# Altium schematic sheet Thermostat Power Supply.SchDoc
size A
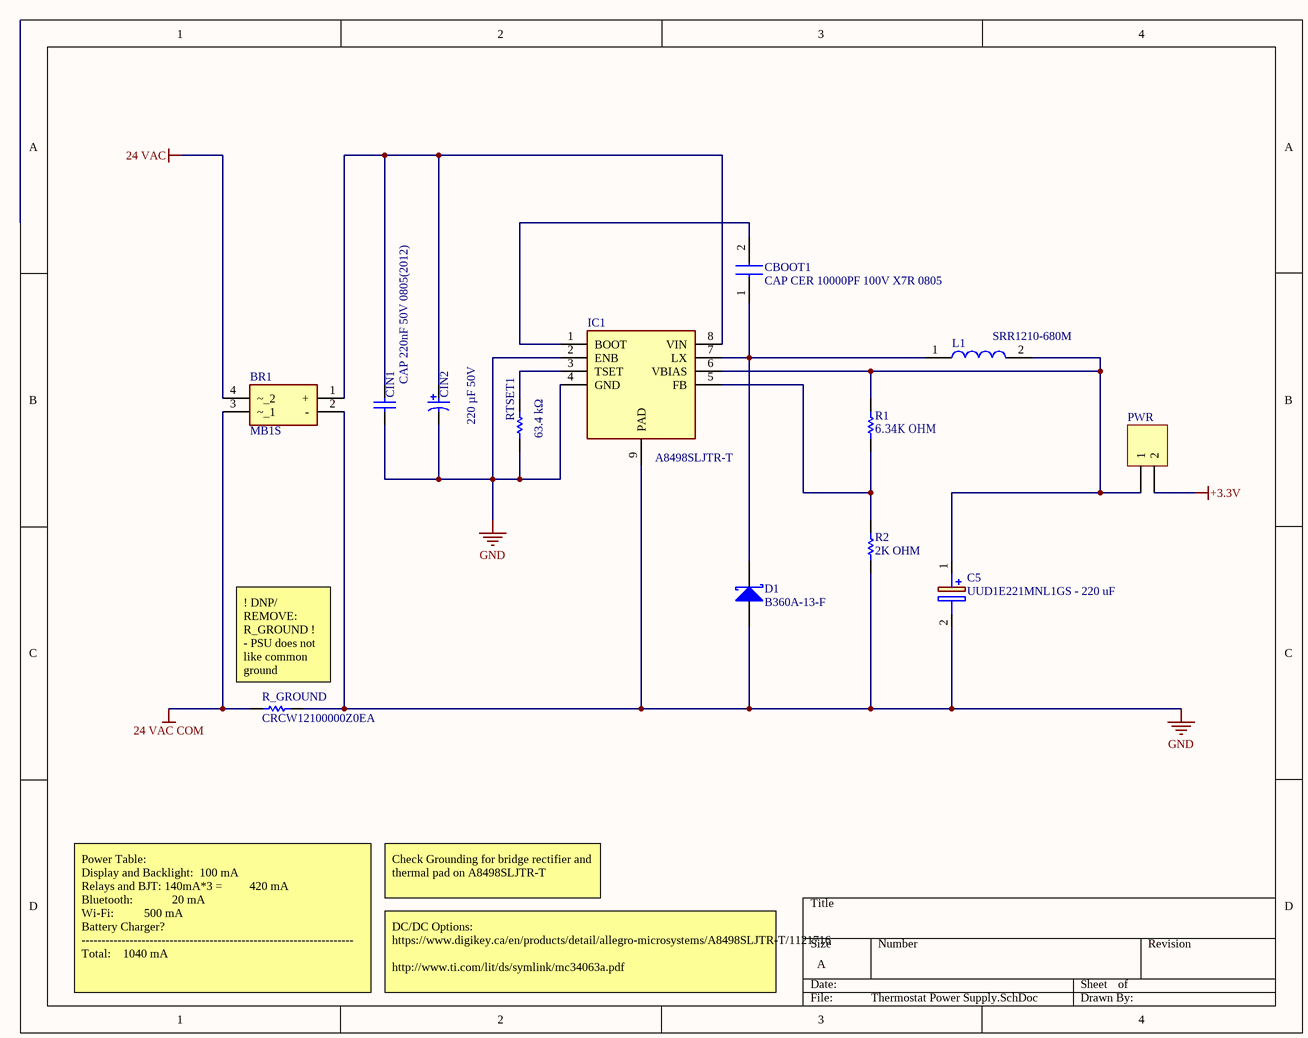
[diagram p0: Thermostat Power Supply.SchDoc]

## Parts
BR1  MB1S  [SOP245P670X290-4N]
C5  UUD1E221MNL1GS - 220 uF  [CAPAE830X1050N]
CBOOT1  CAP CER 10000PF 100V X7R 0805  [CAPC2012X88N]
CIN1  CAP 220nF 50V 0805(2012)  [CAPC0805(2012)145_N]
CIN2  220 µF 50V  [NIC-CAPA2-10X10_V]
D1  B360A-13-F  [DIOD-B360A_V]
IC1  A8498SLJTR-T  [SOIC127P600X170-9N]
L1  SRR1210-680M  [SRR1210]
PWR  Header 2  [HDR1X2]  (value not drawn)
R1  ‎6.34K OHM ‎  [RESC2013X60X35NL10T20]
R2  2K OHM  [RESC2013X60X35ML10T20]
R_GROUND  CRCW12100000Z0EA  [RESC3225X60X45NL20T20]
RTSET1  63.4 kΩ  [RESC2013X60X40NL20T25]

## Nets
24 VAC: BR1.4(~_2)
24 VAC COM: BR1.3(~_1) R_GROUND.1
+3.3V: PWR.2
GND: BR1.2(-) C5.2(-) CIN1.1 CIN2.2 D1.1(A) IC1.2(ENB) IC1.4(GND) IC1.9(PAD) R2.1 R_GROUND.2 RTSET1.1
NetBR1_1: BR1.1(+) CIN1.2 CIN2.1 IC1.8(VIN)
NetC5_1: C5.1(+) IC1.6(VBIAS) L1.2 PWR.1 R1.2
NetCBOOT1_1: CBOOT1.1 D1.2(K) IC1.7(LX) L1.1
NetCBOOT1_2: CBOOT1.2 IC1.1(BOOT)
NetIC1_3: IC1.3(TSET) RTSET1.2
NetIC1_5: IC1.5(FB) R1.1 R2.2

## Notes on the sheet
- (near R_GROUND) ! DNP/ REMOVE: R_GROUND !
  - PSU does not like common ground
- Check Grounding for bridge rectifier and thermal pad on A8498SLJTR-T
- Power Table:
  Display and Backlight: 	100 mA
  Relays and BJT: 140mA*3 =         420 mA
  Bluetooth:		           20 mA
  Wi-Fi:			       500 mA
  Battery Charger?
  --------------------------------------------------------------------
  Total:			 1040 mA
- DC/DC Options:
  https://www.digikey.ca/en/products/detail/allegro-microsystems/A8498SLJTR-T/1121716
  http://www.ti.com/lit/ds/symlink/mc34063a.pdf

## Library data of the parts
BR1 = MB1S: Bridge Rectifier; Manufacturer_Name: ON Semiconductor; Datasheet Link: http://www.onsemi.com/pub/Collateral/MB8S-D.PDF; Height: 2.9mm; Manufacturer_Part_Number: MB1S; Arrow Part Number: MB1S; Arrow Price/Stock: https://www.arrow.com/en/products/mb1s/on-semiconductor; Mouser Part Number: 512-MB1S; Mouser Price/Stock: https://www.mouser.co.uk/ProductDetail/ON-Semiconductor-Fairchild/MB1S?qs=DPwKKv7J1fwyOHno5d2nnw%3D%3D
C5 = UUD1E221MNL1GS: Capacitor Polarised; Manufacturer_Name: Nichicon; Datasheet Link: https://www.mouser.com/datasheet/2/293/e-uud-1513238.pdf; Height: 10.5mm; Manufacturer_Part_Number: UUD1E221MNL1GS; Arrow Part Number: UUD1E221MNL1GS; Arrow Price/Stock: https://www.arrow.com/en/products/uud1e221mnl1gs/nichicon; Mouser Part Number: 647-UUD1E221MNL; Mouser Price/Stock: https://www.mouser.com/Search/Refine.aspx?Keyword=647-UUD1E221MNL
CBOOT1 = C0805C103K1RACTU: Capacitor; Manufacturer_Name: Kemet; Datasheet Link: http://uk.rs-online.com/web/p/products/2989309; Height: 0.88mm; Manufacturer_Part_Number: C0805C103K1RACTU; Arrow Part Number: C0805C103K1RACTU; Arrow Price/Stock: https://www.arrow.com/en/products/c0805c103k1ractu/kemet-corporation; Mouser Part Number: 80-C0805C103K1R; Mouser Price/Stock: https://www.mouser.co.uk/ProductDetail/KEMET/C0805C103K1RACTU?qs=5x48ZXzl2vJIYri9GAI7yw%3D%3D
CIN1 = CMP-1036-04552-1: CAP 220nF 50V ±10% 0805 (2012 Metric) Thickness 1.45mm SMD; Tolerance: Â±10%; Case-Metric: 2012; Case-EIA: 0805; Value: 220nF; Max Thickness: 1.45 mm; Technology: SMT; Rated Voltage: 50 V
CIN2 = CMP-0687-00004-1: Aluminum Electrolytic Capacitor, UD Series, Low Impedance, 220 uF, 50 V, + / - 20%, -55 to 105 degC, Chip Type, 10 x 10 mm D x L, Pb-Free, Reel; PartNumber: UUD1H221MNL1GS; Manufacturer: Nichicon; Rated Capacitance: 220 uF; Packing: Dia382mm Reel; Endurance Time: 5000 h; Rated Ripple Current (at 100kHz): 670 mA; Tolerance Rated Capacitance: -20 to 20%; Impedance: 0.18 Ohm; RoHS: TRUE; ComponentLink2URL: http://products.nichicon.co.jp/en/pdf/XJA043/e-ud.pdf; ComponentLink3URL: http://products.nichicon.co.jp/en/pdf/XJA043/e-ud.pdf; Mounting Technology: Surface Mount; ComponentLink1Description: Manufacturer URL; ComponentLink3Description: Package Specification; ComponentLink1URL: http://www.nichicon.co.jp/; Diameter: 10 mm; PackageDescription: 2-Pin Surface Mount Device, Diameter 10 mm, Height 10 mm, Pitch 8 mm; PackageReference: CAPAE-D10H10; ComponentLink2Description: Datasheet; Rated Voltage: 50 V; DatasheetVersion: 08/2012; Length: 10 mm
D1 = CMP-2000-05898-1: Schottky Barrier Rectifier, 3 A, -55 to 150 degC, 2-Pin Molded, RoHS, Tape and Reel; Manufacturer: DiodesIncorporated; Vf - Forward Voltage: 0.7V; Ifsm - Forward Surge Current: 80A; If - Forward Current: 3A; Unit Weight: 0.002258oz; Ir - Reverse Current: 500uA; Vrrm - Repetitive Reverse Voltage: 60V; Configuration: Single; Length: 4.6mm; Datasheet Version: Rev. 15-2, 09/2014; Technology: Si; Factory Pack Quantity: 5000; Manufacturer URL: http://www.diodes.com/; Type: SchottkyBarrierRectifier; Product Category: SchottkyDiodes&Rectifiers; Minimum Operating Temperature: -55C; Packaging: Reel; Product: SchottkyDiodes; Height: 2.3mm; Datasheet URL: https://datasheet.ciiva.com/914/ds30891-914080.pdf; Series: B360; Brand: DiodesIncorporated; Maximum Operating Temperature: +125C; Termination Style: SMD/SMT; Package / Case: SMA; Mounting Style: SMD/SMT; RoHS: True; Package Description: 2-Pin Surface Mount Device, Body 4.3 x 2.605 mm; Operating Temperature Range: -55Cto+125C; Package Reference: B360A; Width: 2.92mm; Mounting Technology: SurfaceMount
IC1 = A8498SLJTR-T: Integrated Circuit; Manufacturer_Name: Allegro Microsystems; Datasheet Link: http://www.allegromicro.com/~/media/files/datasheets/a8498-datasheet.ashx; Height: 1.7mm; Manufacturer_Part_Number: A8498SLJTR-T; Arrow Part Number: A8498SLJTR-T; Arrow Price/Stock: https://www.arrow.com/en/products/a8498sljtr-t/allegro-microsystems
L1 = SRR1210-680M: Inductor; Manufacturer_Name: Bourns; Datasheet Link: https://www.bourns.com/pdfs/SRR1210.pdf; Manufacturer_Part_Number: SRR1210-680M; Arrow Part Number: SRR1210-680M; Arrow Price/Stock: https://www.arrow.com/en/products/srr1210-680m/bourns; Mouser Part Number: 652-SRR1210-680M; Mouser Price/Stock: https://www.mouser.co.uk/ProductDetail/Bourns/SRR1210-680M?qs=4vvWAaIu%2Fq7jxuGAr15C2Q%3D%3D
PWR = Header 2: Header, 2-Pin; LatestRevisionDate: 17-Jul-2002; LatestRevisionNote: Re-released for DXP Platform.; Publisher: Altium Limited
R1 = CMP-2001-01252-1: RES 6.34K OHM; Manufacturer: Yageo; Part Number: RC0805FR-076R34L
R2 = CMP-2001-01361-1: Manufacturer: Yageo; Part Number: RC0805JR-072KL
R_GROUND = CMP-2005-01987-1: Manufacturer: Vishay Dale; Part Number: CRCW12100000Z0EA
RTSET1 = CMP-2001-00862-1: Manufacturer: Panasonic; Part Number: ERA6AEB6342V